# EAGLE design OPA1622 - Gain Stage (EAGLE 6.4)
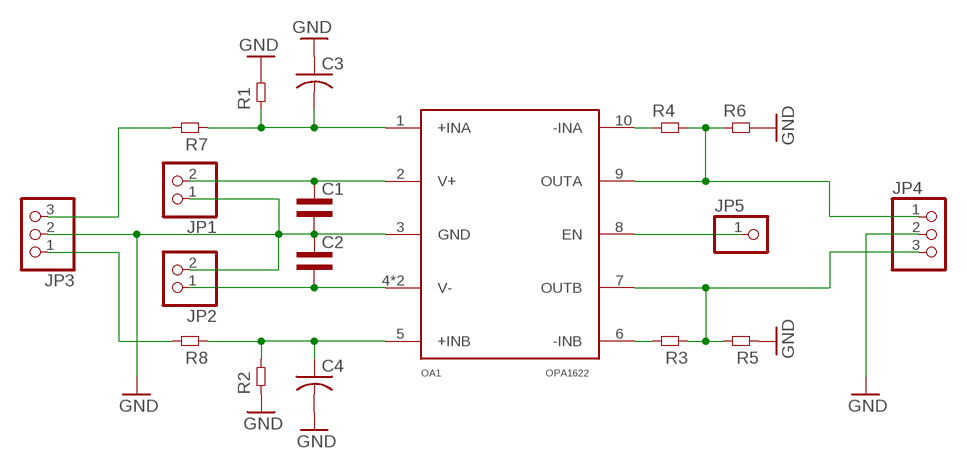
[diagram p0: schematic, sheet 1]

## Parts
C1  CAP0603L3  [0603L3]
C2  CAP0603L3  [0603L3]
C3  C-US025-050X050  [C025-050X050]
C4  C-US025-050X050  [C025-050X050]
JP1  PINHD-1X2  [1X02]
JP2  PINHD-1X2  [1X02]
JP3  PINHD-1X3  [1X03]
JP4  PINHD-1X3  [1X03]
JP5  PINHD-1X1  [1X01]
OA1  OPA1622  [S-PVSON-N10]
R1  RES0603L3  [0603L3]
R2  RES0603L3  [0603L3]
R3  RES0603L3  [0603L3]
R4  RES0603L3  [0603L3]
R5  RES0603L3  [0603L3]
R6  RES0603L3  [0603L3]
R7  RES0603L3  [0603L3]
R8  RES0603L3  [0603L3]

## Nets
GND: C1.P$2 C2.P$1 C3.1 C4.2 JP1.1 JP2.2 JP3.2 JP4.2 OA1.3(GND) R1.P$2 R2.P$1 R5.P$1 R6.P$2
N$1: OA1.6(-INB) R3.P$2
N$2: OA1.10(-INA) R4.P$1
N$3: JP4.1 OA1.9(OUTA) R4.P$2 R6.P$1
N$4: C4.1 OA1.5(+INB) R2.P$2 R8.P$1
N$5: C3.2 OA1.1(+INA) R1.P$1 R7.P$1
N$6: JP4.3 OA1.7(OUTB) R3.P$1 R5.P$2
N$7: JP3.3 R7.P$2
N$8: JP3.1 R8.P$2
N$9: JP5.1 OA1.8(EN)
V+: C1.P$1 JP1.2 OA1.2(V+)
V-: C2.P$2 JP2.1 OA1.4(V-) OA1.TP(V-)

## Library data of the parts
C1 C2 = common:CAP
C3 C4 = rcl:C-US: CAPACITOR, American symbol
JP1 JP2 = pinhead:PINHD-1X2: PIN HEADER
JP3 JP4 = pinhead:PINHD-1X3: PIN HEADER
JP5 = pinhead:PINHD-1X1: PIN HEADER
OA1 = common:OPA1622
R1-R8 = common:RES

## Board
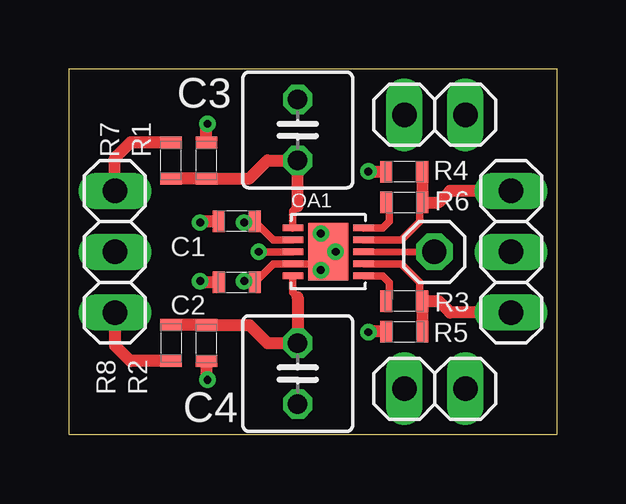
[diagram p1: board, top side]
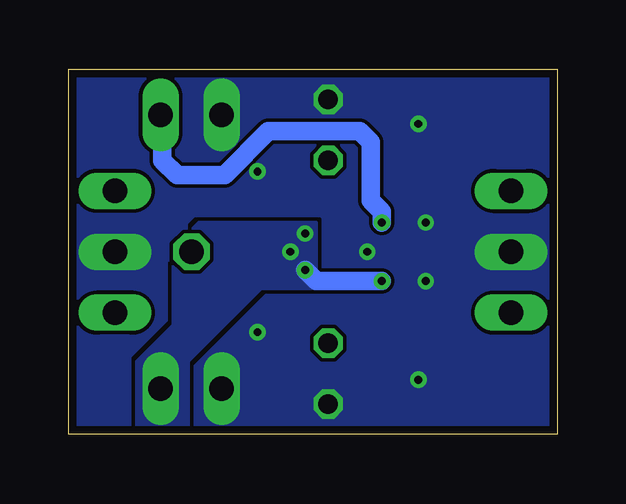
[diagram p2: board, bottom side, seen from below]

Size 20.37 x 15.24 mm. Coordinates in mm from the lower left corner, seen from the top.
Outline: 0,0 20.37,0 20.37,15.24 0,15.24 0,0
Copper layers (1*16): Top 0.035mm / dielectric 1.5mm / Bottom 0.035mm
Design rules "default *": minimum track width 6mil, minimum drill 13mil, track to track 6mil, track to pad 6mil, pad to pad 6mil, via to via 6mil, smd to smd 6mil, copper to edge 13mil, drill to drill 6mil, minimum pad ring 7mil, minimum via ring 7mil, stop-mask expansion 4mil, vias tented up to drill 0mil, thermal gap 10mil

### Footprints (pad centres in the part's own frame; a part is rotated, then mirrored left to right if it is on the bottom)
0603L3 = smd 0.5 x 0.9: P$1 -0.75,0; P$2 0.75,0
C025-050X050 = drill 0.813 octagon: 1 -1.27,0; 2 1.27,0
1X02 = drill 1.016 long: 1 -1.27,0; 2 1.27,0
1X03 = drill 1.016 long: 1 -2.54,0; 2 0,0; 3 2.54,0
1X01 = drill 1.016 octagon: 1 0,0
S-PVSON-N10 = smd 0.28 x 0.85: 1 -1,-1.475; 2 -0.5,-1.475; 3 0,-1.475; 4 0.5,-1.475; 5 1,-1.475; 6 1,1.475; 7 0.5,1.475; 8 0,1.475; 9 -0.5,1.475; 10 -1,1.475 | smd 2.4 x 1.65: TP 0,0

### Placement (x,y rotation side)
C1  7.01,8.89 180 top
C2  7.01,6.35 0 top
C3  9.55,12.7 270 top
C4  9.55,2.54 270 top
JP1  15.27,13.34 0 top
JP2  15.27,1.91 180 top
JP3  1.93,7.62 90 top
JP4  18.44,7.62 270 top
JP5  15.24,7.62 0 top
OA1  10.82,7.62 270 top
R1  5.74,11.43 90 top
R2  5.74,3.81 90 top
R3  14,5.56 180 top
R4  14,9.68 0 top
R5  14,4.29 0 top
R6  14,10.95 180 top
R7  4.27,11.43 90 top
R8  4.27,3.81 270 top

### Tracks (layer width: path | path; a pad name or v marks a point on that pad's centre or on a via)
GND  (via drill 0.33)
  Top 0.305: OA1.3 v7.92,7.62
  Top 0.508: R5.P$1 12.52,4.29 v12.5,4.27 | v12.5,10.97 13.22,10.97 R6.P$2 | R1.P$2 5.74,12.9 v5.79,12.95 | C1.P$2 5.54,8.89 v5.49,8.84 | C2.P$1 5.54,6.35 v5.49,6.4 | R2.P$1 5.74,2.34 v5.79,2.29
  pour Bottom (rank 6, no thermals): 0.15,15.09 20.27,15.09 20.27,0.15 0.15,0.15
N$1
  Top 0.305: OA1.6 13.09,6.62 13.36,6.35 13.36,5.68 R3.P$2
N$2
  Top 0.305: OA1.10 13.09,8.62 13.36,8.89 13.36,9.56 R4.P$1
N$3
  Top 0.305: OA1.9 13.86,8.12 14.63,8.89 14.63,9.56 R4.P$2
  Top 0.508: JP4.1 15.9,10.16 15.42,9.68 R4.P$2 R6.P$1
N$4
  Top 0.305: OA1.5 9.35,5.92 9.55,5.72
  Top 0.508: 9.55,5.72 C4.1 8.28,3.81 7.53,4.56 R2.P$2 R8.P$1
N$5
  Top 0.305: OA1.1 9.35,9.32 9.55,9.52
  Top 0.508: 9.55,9.52 C3.2 8.28,11.43 7.53,10.68 R1.P$1 R7.P$1
N$6
  Top 0.305: OA1.7 13.86,7.12 14.63,6.35 14.63,5.68 R3.P$1
  Top 0.508: JP4.3 15.9,5.08 15.42,5.56 R3.P$1 R5.P$2
N$7
  Top 0.508: JP3.3 1.93,11.53 2.58,12.18 R7.P$2
N$8
  Top 0.508: JP3.1 1.93,3.71 2.58,3.06 R8.P$2
N$9
  Top 0.279: OA1.8 JP5.1
V+  (via drill 0.33)
  Top 0.305: OA1.2 8.53,8.12 C1.P$1
  Top 0.508: C1.P$1 7.76,8.83 v7.32,8.84
  Bottom 0.762: v7.32,8.84 7.32,9.3 7.77,9.75 7.77,12.19 8.23,12.65 12.04,12.65 13.87,10.82 15.85,10.82 16.46,11.43 16.46,13.26 JP1.2
V-  (via drill 0.33)
  Top 0.305: C2.P$2 8.53,7.12 OA1.4 10.32,7.12 OA1.TP
  Top 0.508: C2.P$2 7.76,6.41 v7.32,6.4
  Top 0.762: OA1.TP v11.13,7.62
  Bottom 0.762: v7.32,6.4 10.06,6.4 v10.52,6.86
  other vias: 10.52,8.38
  pour Bottom (no thermals): 10.06,8.84 14.94,8.84 16,7.77 16,4.57 17.53,3.05 17.53,0.15 15.39,0.15 15.39,3.05 12.34,6.1 10.06,6.1